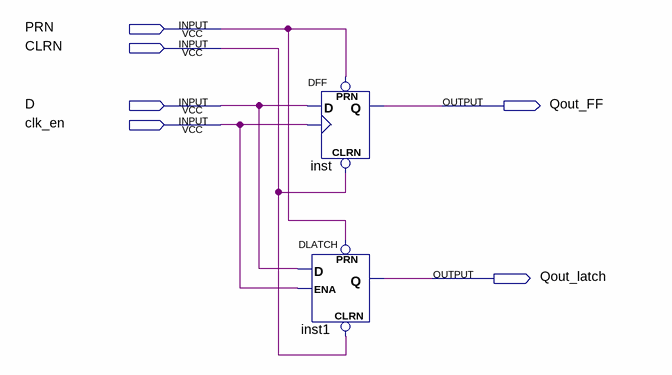
[diagram p0: schematic sheet]
// Quartus schematic d_test.bdf as structural Verilog: 2 symbols, 6 pins
module d_test (
  input  PRN,
  input  CLRN,
  input  D,
  input  clk_en,
  output Qout_FF,
  output Qout_latch
);

  DFF inst (.CLRN(CLRN), .CLK(clk_en), .D(D), .PRN(PRN), .Q(Qout_FF));
  DLATCH inst1 (.CLRN(CLRN), .D(D), .ENA(clk_en), .PRN(PRN), .Q(Qout_latch));
endmodule
